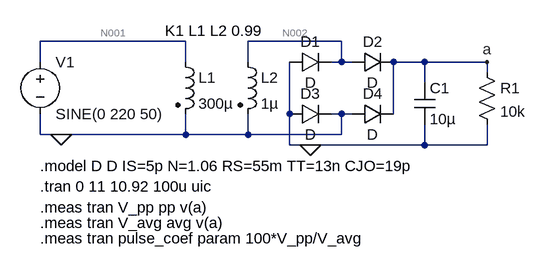
[diagram p0: schematic 2.2.asc]
2.2.asc, the LTspice schematic file:
Version 4
SHEET 1 1076 680
WIRE 320 80 96 80
WIRE 560 80 416 80
WIRE 96 112 96 80
WIRE 320 112 320 80
WIRE 416 112 416 80
WIRE 560 112 560 80
WIRE 560 112 544 112
WIRE 576 112 560 112
WIRE 688 112 640 112
WIRE 784 112 688 112
WIRE 784 128 784 112
WIRE 688 144 688 112
WIRE 480 192 480 112
WIRE 560 192 544 192
WIRE 576 192 560 192
WIRE 640 192 640 112
WIRE 96 224 96 192
WIRE 128 224 96 224
WIRE 320 224 320 192
WIRE 320 224 128 224
WIRE 416 224 416 192
WIRE 416 224 320 224
WIRE 560 224 560 192
WIRE 560 224 416 224
WIRE 480 240 480 192
WIRE 512 240 480 240
WIRE 688 240 688 208
WIRE 688 240 512 240
WIRE 784 240 784 208
WIRE 784 240 688 240
FLAG 128 224 0
FLAG 784 112 a
FLAG 512 240 0
SYMBOL voltage 96 96 R0
WINDOW 123 0 0 Left 0
WINDOW 39 0 0 Left 0
SYMATTR InstName V1
SYMATTR Value SINE(0 220 50)
SYMBOL ind2 304 96 R0
SYMATTR InstName L1
SYMATTR Value 300µ
SYMATTR SpiceLine Rser=10m
SYMATTR Type ind
SYMBOL ind2 400 96 R0
SYMATTR InstName L2
SYMATTR Value 1µ
SYMATTR SpiceLine Rser=10m
SYMATTR Type ind
SYMBOL cap 672 144 R0
SYMATTR InstName C1
SYMATTR Value 10µ
SYMBOL res 768 112 R0
SYMATTR InstName R1
SYMATTR Value 10k
SYMBOL diode 480 128 R270
WINDOW 0 32 32 VTop 2
WINDOW 3 0 32 VBottom 2
SYMATTR InstName D1
SYMBOL diode 576 128 R270
WINDOW 0 32 32 VTop 2
WINDOW 3 0 32 VBottom 2
SYMATTR InstName D2
SYMBOL diode 480 208 R270
WINDOW 0 32 32 VTop 2
WINDOW 3 0 32 VBottom 2
SYMATTR InstName D3
SYMBOL diode 576 208 R270
WINDOW 0 32 32 VTop 2
WINDOW 3 0 32 VBottom 2
SYMATTR InstName D4
TEXT 96 272 Left 2 !.model D D IS=5p N=1.06 RS=55m TT=13n CJO=19p
TEXT 288 64 Left 2 !K1 L1 L2 0.99
TEXT 96 304 Left 2 !.tran 0 11 10.92 100u uic
TEXT 96 336 Left 2 !.meas tran V_pp pp v(a)
TEXT 96 360 Left 2 !.meas tran V_avg avg v(a)
TEXT 96 384 Left 2 !.meas tran pulse_coef param 100*V_pp/V_avg

The netlist it stands for:
* 2.2.asc
V1 N001 0 SINE(0 220 50)
L1 N001 0 300µ Rser=10m
L2 N002 0 1µ Rser=10m
C1 a 0 10µ
R1 a 0 10k
D1 0 N002 D
D2 N002 a D
D3 0 0 D
D4 0 a D
.model D D
.lib standard.dio
.model D D IS=5p N=1.06 RS=55m TT=13n CJO=19p
K1 L1 L2 0.99
.tran 0 11 10.92 100u uic
.meas tran V_pp pp v(a)
.meas tran V_avg avg v(a)
.meas tran pulse_coef param 100*V_pp/V_avg
.backanno
.end

* Results of the author's LTspice run, read from the files saved beside the schematic
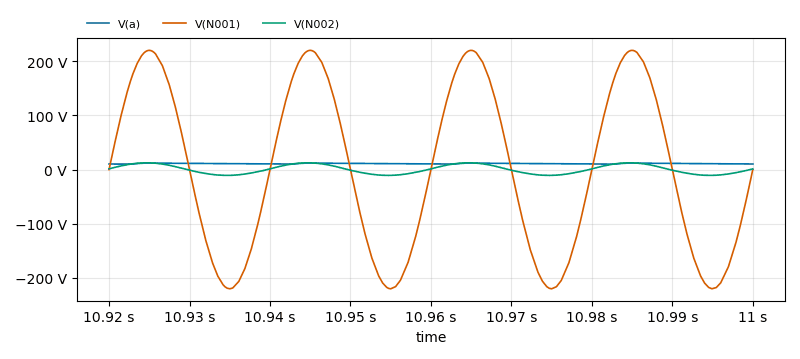
[diagram p1: Transient Analysis of 2.2.asc, plotted from the saved traces]
* Transient Analysis, 1 run:
*   V(a): min 10 V, max 11.96 V, average 10.99 V, rms 11.01 V, last 10.29 V
*   V(N001): min -220 V, max 220 V, average 97.5 mV, rms 155.5 V, last 0 V
*   V(N002): min -10.71 V, max 12.5 V, average 552.4 mV, rms 8.239 V, last 1.317 V
* From the log:
*   v_pp: PP(v(a))=1.96011 FROM 0 TO 0.08
*   v_avg: AVG(v(a))=10.9911 FROM 0 TO 0.08
*   pulse_coef: 100*v_pp/v_avg=17.8335